# Altium schematic sheet Biological Payload Data Consolidator.SchDoc
size A
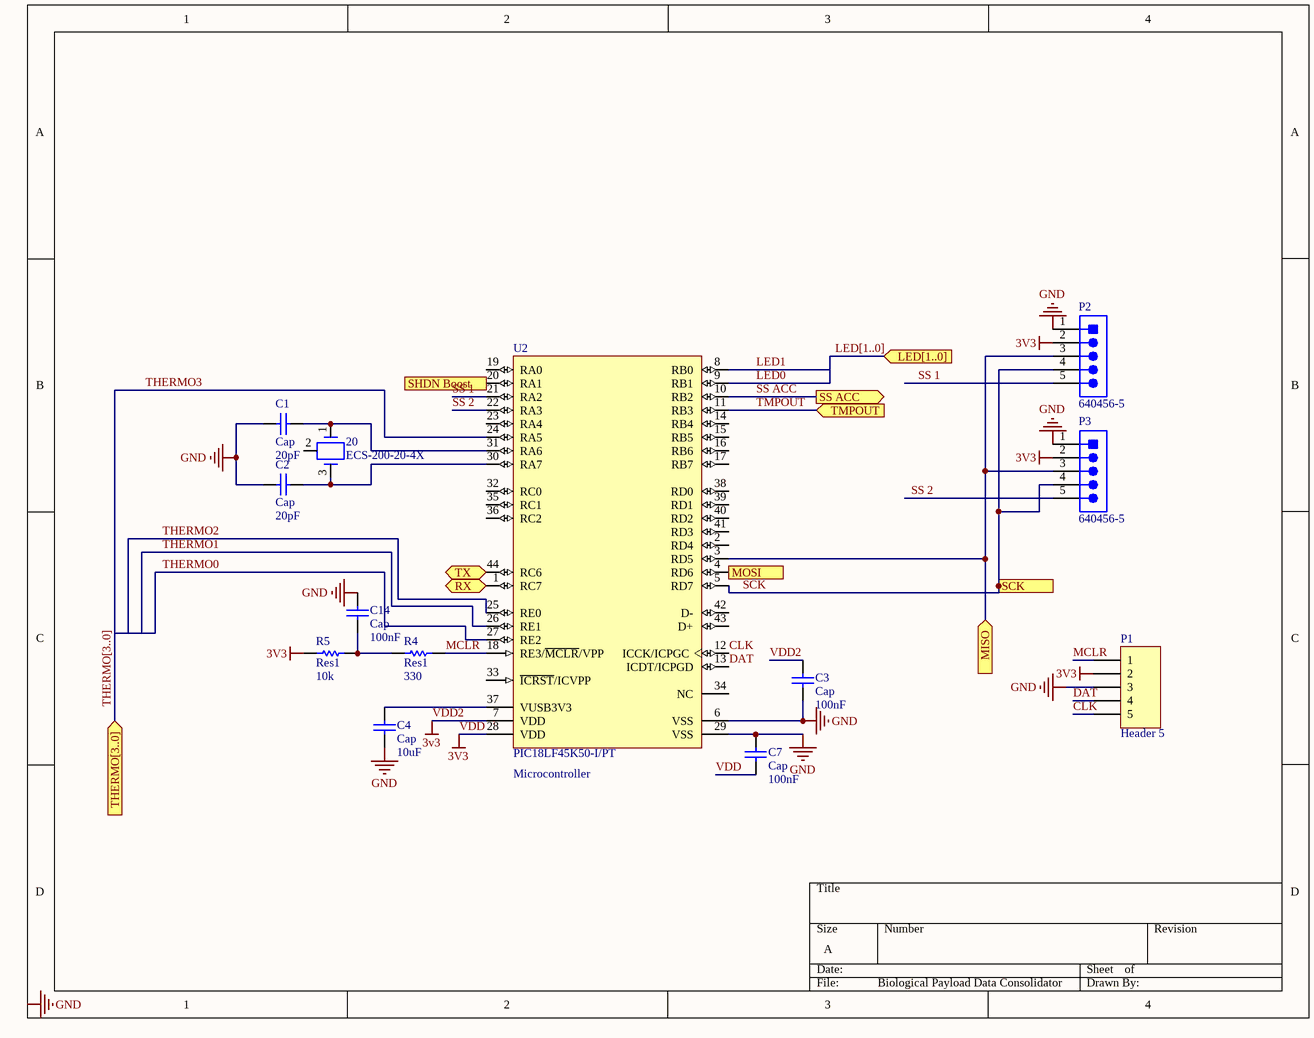
[diagram p0: Biological Payload Data Consolidator.SchDoc]

## Parts
20  ECS-200-20-4X  [ECS-4X-3IL]
C1  Cap  value 20pF  [0402-A]
C2  Cap  value 20pF  [0402-A]
C3  Cap  value 100nF  [1608[0603]]
C4  Cap  value 10uF  [6-0805_M]
C7  Cap  value 100nF  [1608[0603]]
C14  Cap  value 100nF  [1608[0603]]
P1  Header 5  [HDR1X5]
P2  640456-5  [TECO-640456-5]
P3  640456-5  [TECO-640456-5]
R4  Res1  value 330  [1608[0603]]
R5  Res1  value 10k  [0402-A]
U2  PIC18LF45K50-I/PT  [MCHP-TQFP-PT44_L]

## Ports
LED[1..0] (in), MISO (in), MOSI (out), RX (bidir), SCK (out), SHDN Boost (out), SS ACC (out), THERMO[3..0] (in), TMPOUT (in), TX (bidir)

## Nets
GND: C1.2 C2.1 C3.1 C4.2 C7.1 C14.1 P1.3 P2.1(DTR) P3.1(DTR) U2.6(VSS) U2.29(VSS)
VDD: C3.2 C7.2 P1.2 P2.2(RXI) P3.2(RXI) R5.2 U2.7(VDD) U2.28(VDD)  [also labelled 3v3, VDD2]
CLK: P1.5 U2.12(ICCK/ICPGC)
DAT: P1.4 U2.13(ICDT/ICPGD)
LED0: U2.9(RB1)
LED1: U2.8(RB0)
MCLR: P1.1 R4.2 U2.18(RE3/~{MCLR}/VPP)
MISO: P2.3(TXO) P3.3(TXO) U2.3(RD5) ; port MISO
MOSI: U2.4(RD6) ; port MOSI
RX: U2.1(RC7) ; port RX
SCK: P2.4(VCC) P3.4(VCC) U2.5(RD7) ; port SCK
SHDN Boost: U2.20(RA1) ; port SHDN Boost
SS 1: P2.5(CTS) U2.21(RA2)
SS 2: P3.5(CTS) U2.22(RA3)
SS ACC: U2.10(RB2) ; port SS ACC
THERMO0: U2.27(RE2)
THERMO1: U2.26(RE1)
THERMO2: U2.25(RE0)
THERMO3: U2.24(RA5)
TMPOUT: U2.11(RB3) ; port TMPOUT
TX: U2.44(RC6) ; port TX
Net20_1: 20.1 C1.1 U2.31(RA6)
Net20_3: 20.3 C2.2 U2.30(RA7)
NetC4_1: C4.1 U2.37(VUSB3V3)
NetC14_2: C14.2 R4.1 R5.1

Not connected (* = marked no-connect by the designer): 20 2; U2 2(RD4) 14(RB4) 15(RB5) 16(RB6) 17(RB7) 19(RA0) 23(RA4) 32(RC0) 33(~{ICRST}/ICVPP) 34(NC) 35(RC1) 36(RC2) 38(RD0) 39(RD1) 40(RD2) 41(RD3) 42(D-) 43(D+)

## Buses and harness runs
bus LED[1..0] = port LED[1..0]
bus THERMO[3..0] = port THERMO[3..0]

## Notes on the sheet
- (near U2) Microcontroller
- Labels drawn without touching a wire or pin: GND

## Library data of the parts
20 = CMP-1669-00001-2: CRYSTAL 20.000MHZ 20PF 49US; Manufacturer: ECS; ComponentLink1URL: http://www.ecsxtal.com/store/pdf/hc-49usx.pdf; PartNumber: ECS-200-20-4X; ComponentLink1Description: Datasheet; PackageReference: 4X-3IL
C1-C4 C7 C14 = Cap: Capacitor; Published: 8-Jun-2000; LatestRevisionDate: 17-Jul-2002; LatestRevisionNote: Re-released for DXP Platform.; PackageReference: RAD-0.3; Publisher: Altium Limited; PackageDescription: Radial Cap, Thru-Hole; 2 Leads; 0.3 in Pin Spacing
P1 = Header 5: Header, 5-Pin; LatestRevisionDate: 17-Jul-2002; LatestRevisionNote: Re-released for DXP Platform.; Publisher: Altium Limited
P2 P3 = CMP-1684-00014-1: Male Header, Pitch 2.54 mm, 1 x 5 Position, Height 10.03 mm, Tail Length 3.56 mm, / -55 to 105 degC, RoHS, Bulk; Manufacturer: TE Connectivity; Material, Housing: Polyester; Brand/Series: MTA-100Series; Color, Housing: White; Current, Rating: 5 / A; Temperature, Operating: -55to+105 / °C; Connector Type: MTA-100; Agency Approvals: CSA,UL; Material, Contact: CopperAlloy; Mounting Hole Size: 0.04 / "; Voltage, Rating: 250 / V; Contact Termination Area Plating: Tin; Pin Spacing: 0.1 / "; Primary Type: InterconnectSystem; Special Features: Pinstrip; Mount Angle: Vertical; Contact Centerline Spacing: 0.100 / in.; Number of Contacts: 5; Standards: RoHSCompliant,ELVCompliant,UL94V-0; Angle: Straight; Length, Terminal Post: 0.14 / in.; Manufacturer URL: http://www.te.com; Flammability Rating: UL94V-0; Mounting Type: PCMount; Termination: Solder; Package Reference: THD; Length, Overall: 0.5 / "; Contact Mating Area Plating: Tin; Length, Pin: 0.14 / "; Datasheet URL: http://sigma.octopart.com/77881742/technical_drawing/TE-Connectivity-640456-5.pdf; Package Description: Male Header, Pitch 2.54 mm, 1 x 5 Position, Height 10.03 mm, Tail Length 3.56 mm; Datasheet Version: Rev. W3; Contact Plating: Tin; Color: White; Number of Positions: 5; Type: PCBPlug; Contact Shape: Square; Number of Rows: 1; Size, Post: 0.025 / in.
R4 R5 = Res1: Resistor; Published: 8-Jun-2000; LatestRevisionDate: 17-Jul-2002; LatestRevisionNote: Re-released for DXP Platform.; PackageReference: AXIAL-0.3; Publisher: Altium Limited; PackageDescription: Axial Device, Thru-Hole; 2 Leads; 0.3 in Pin Spacing
U2 = CMP-0116-01766-1: Low-Power, High-Performance Microcontroller with XLP Technology, 48 MHz, 36 I/O, -40 to 85 degC, 44-pin TQFP (PT44), Tray; Manufacturer: Microchip; Timers: 2 - 8-bit, 2 - 16-bit, 0 - 32-bit; Operation Voltage Range: 1.8V - 3.6V; RAM: 2048; Max. CPU Speed MHz: 48; Memory Type: Flash; Program Memory KWords: 16; EEPROM Data Memory (bytes): 256; Internal Oscillator: 16 MHz, 31 kHz; I/O Pins: 36; Program Memory KBytes: 32; # of A/D Channels: 25; Digital Communication: 1 -A/E/USART, 1 -MSSP(SPI/I2C); ComponentLink3URL: Product URL:http://www.microchip.com/datasheet/PIC18F45K50; PackageReference: TQFP-PT44; Packing: TRAY; PartNumber: PIC18LF45K50-I/PT; Mounting Technology: Surface Mount; PackageVersion: C04-076B, 12/2012; PackageDescription: 44-Lead Plastic Thin Quad Flatpack, 10 x 10 mm Body, 0.8 mm Pitch; ComponentLink2URL: http://www.microchip.com/stellent/groups/techpub_sg/documents/packagingspec/en012702.pdf; ComponentLink3Description: URL Link1; ComponentLink2Description: Package Specification; DatasheetVersion: Rev. A; ComponentLink1URL: http://ww1.microchip.com/downloads/en/DeviceDoc/30684A.pdf; ComponentLink1Description: Datasheet